# Altium schematic sheet Main.SchDoc
size A3; SheetNumber: 1; SheetTotal: 4
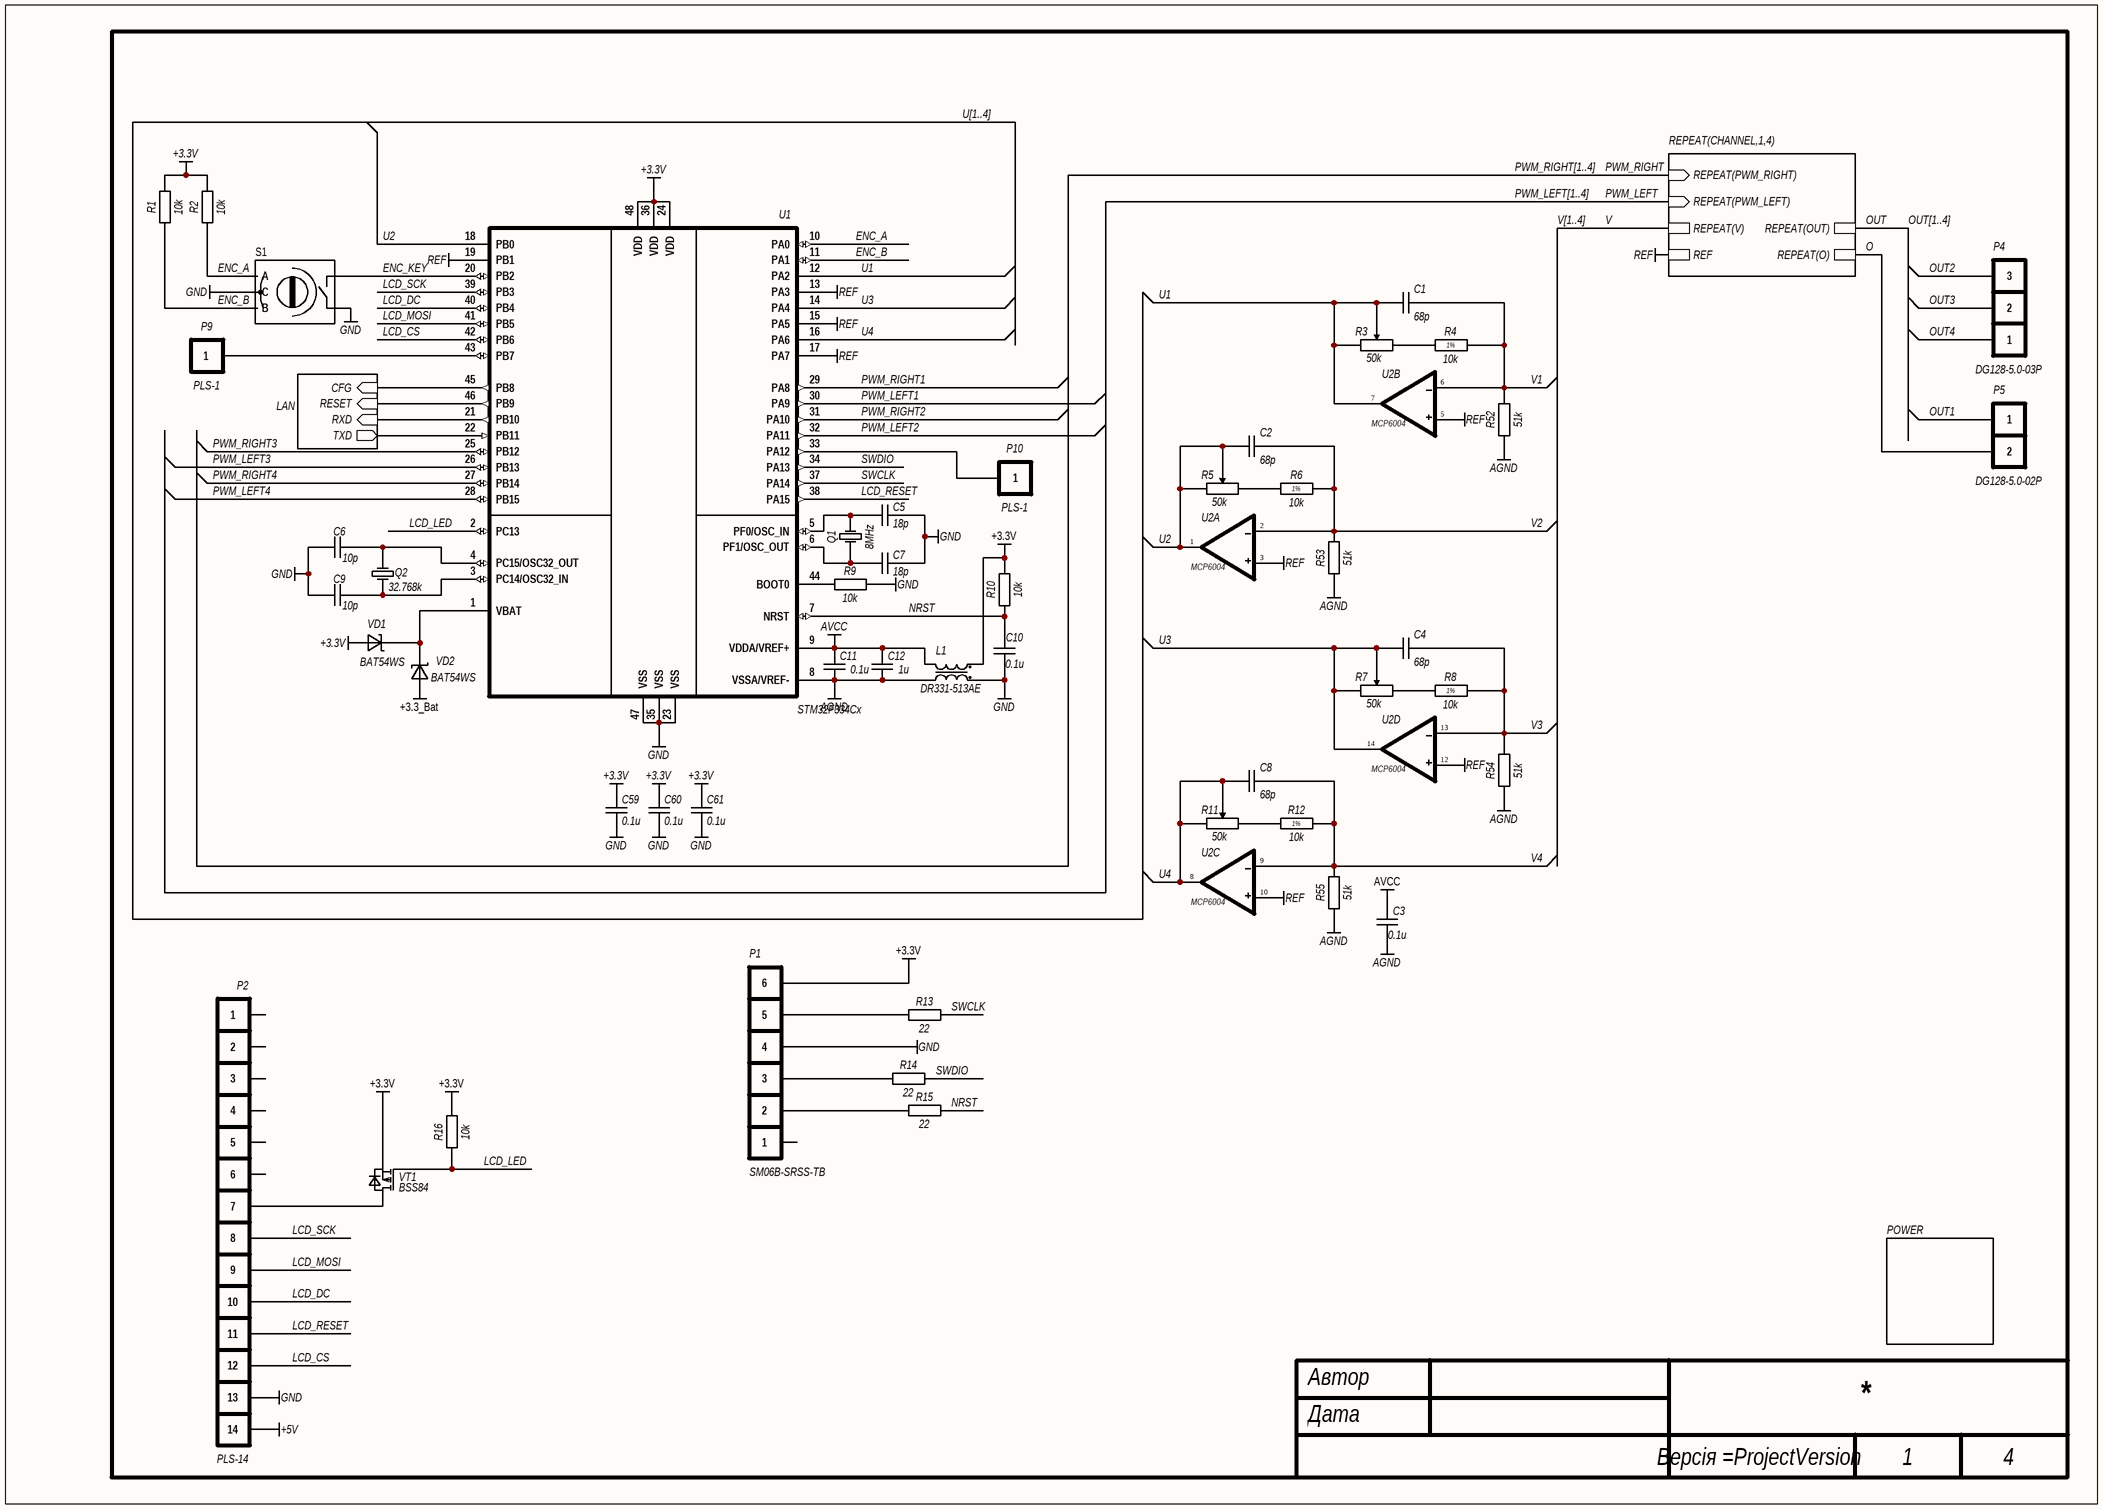
[diagram p0: Main.SchDoc]

## Parts
C1  68p  [C0603(1608)]
C2  68p  [C0603(1608)]
C3  0.1u  [C0603(1608)]
C4  68p  [C0603(1608)]
C5  18p  [C0603(1608)]
C6  10p  [C0603(1608)]
C7  18p  [C0603(1608)]
C8  68p  [C0603(1608)]
C9  10p  [C0603(1608)]
C10  0.1u  [C0603(1608)]
C11  0.1u  [C0603(1608)]
C12  1u  [C0603(1608)]
C59  0.1u  [C0603(1608)]
C60  0.1u  [C0603(1608)]
C61  0.1u  [C0603(1608)]
L1  DR331-513AE  [DR331]
P1  SM06B-SRSS-TB  [SM06B-SRSS-TB]
P2  PLS-14  [PLS-14]
P4  DG128-5.0-03P  [DG128-5.0-03P]
P5  DG128-5.0-02P  [DG128-5.0-02P]
P9  PLS-1  [PLS-1]
P10  PLS-1  [PLS-1]
Q1  8MHz  [KX-7T]
Q2  32.768k  [KX-327S]
R1  10k  [R0603]
R2  10k  [R0603]
R3  50k  [T910W (3296W)]
R4  10k  Accuracy: 1%  [R0603]
R5  50k  [T910W (3296W)]
R6  10k  Accuracy: 1%  [R0603]
R7  50k  [T910W (3296W)]
R8  10k  Accuracy: 1%  [R0603]
R9  10k  [R0603]
R10  10k  [R0603]
R11  50k  [T910W (3296W)]
R12  10k  Accuracy: 1%  [R0603]
R13  22  [R0603]
R14  22  [R0603]
R15  22  [R0603]
R16  10k  [R0603]
R52  51k  [R0603]
R53  51k  [R0603]
R54  51k  [R0603]
R55  51k  [R0603]
S1  EC12D  [EC12D]  (value not drawn)
U1  STM32F334Сx  [LQFP48]  (value not drawn)
U2  MCP6004  [TSSOP-14]  (parts A,B,C,D of 4)
VD1  BAT54WS  [SOD323]
VD2  BAT54WS  [SOD323]
VT1  BSS84  [SOT23]

## Sub-sheets
LAN = LAN.SchDoc: CFG (in), RESET (in), TXD (out), RXD (in)
POWER = Power.SchDoc: no entries
REPEAT(CHANNEL,1,4) = Channel.SchDoc: REF, REPEAT(V), REPEAT(PWM_LEFT) (in), REPEAT(PWM_RIGHT) (in), REPEAT(OUT), REPEAT(O)

## Nets
+3.3_Bat: VD2.1(A)
+3.3V: C59.2 C60.2 C61.2 L1.2 P1.6 R1.2 R2.2 R10.2 R16.2 U1.24(VDD) U1.36(VDD) U1.48(VDD) VD1.1(A) VT1.2(S)
+5V: P2.14
AGND: C3.1 C11.1 C12.1 L1.4 R52.1 R53.1 R54.1 R55.1 U1.8(VSSA/VREF-) U2.11(V-)
AVCC: C3.2 C11.2 C12.2 L1.3 U1.9(VDDA/VREF+) U2.4(V+)
GND: C5.2 C6.2 C7.2 C9.2 C10.1 C59.1 C60.1 C61.1 L1.1 P1.4 P2.13 R9.2 S1.C S1.E U1.23(VSS) U1.35(VSS) U1.47(VSS)
REF: U1.13(PA3) U1.15(PA5) U1.17(PA7) U1.19(PB1) U2.3(+IN) U2.5(+IN) U2.10(+IN) U2.12(+IN) ; sheet REPEAT(CHANNEL,1,4)/REF
ENC_A: R2.1 S1.A U1.10(PA0)
ENC_B: R1.1 S1.B U1.11(PA1)
ENC_KEY: S1.D U1.20(PB2)
LCD_CS: P2.12 U1.42(PB6)
LCD_DC: P2.10 U1.40(PB4)
LCD_LED: R16.1 U1.2(PC13) VT1.1(G)
LCD_MOSI: P2.9 U1.41(PB5)
LCD_RESET: P2.11 U1.38(PA15)
LCD_SCK: P2.8 U1.39(PB3)
NRST: C10.2 R10.1 R15.2 U1.7(NRST)
O: P5.2 ; sheet REPEAT(CHANNEL,1,4)/REPEAT(O)
OUT: sheet REPEAT(CHANNEL,1,4)/REPEAT(OUT)
OUT1: P5.1
OUT2: P4.3
OUT3: P4.2
OUT4: P4.1
PWM_LEFT: sheet REPEAT(CHANNEL,1,4)/REPEAT(PWM_LEFT)
PWM_LEFT1: U1.30(PA9)
PWM_LEFT2: U1.32(PA11)
PWM_LEFT3: U1.26(PB13)
PWM_LEFT4: U1.28(PB15)
PWM_RIGHT: sheet REPEAT(CHANNEL,1,4)/REPEAT(PWM_RIGHT)
PWM_RIGHT1: U1.29(PA8)
PWM_RIGHT2: U1.31(PA10)
PWM_RIGHT3: U1.25(PB12)
PWM_RIGHT4: U1.27(PB14)
SWCLK: R13.2 U1.37(PA14)
SWDIO: R14.2 U1.34(PA13)
U1: C1.2 R3.2 R3.3 U1.12(PA2) U2.7(OUT)
U2: C2.2 R5.2 R5.3 U1.18(PB0) U2.1(OUT)
U3: C4.2 R7.2 R7.3 U1.14(PA4) U2.14(OUT)
U4: C8.2 R11.2 R11.3 U1.16(PA6) U2.8(OUT)
V: sheet REPEAT(CHANNEL,1,4)/REPEAT(V)
V1: C1.1 R4.1 R52.2 U2.6(-IN)
V2: C2.1 R6.1 R53.2 U2.2(-IN)
V3: C4.1 R8.1 R54.2 U2.13(-IN)
V4: C8.1 R12.1 R55.2 U2.9(-IN)
NetC5_1: C5.1 Q1.1 U1.5(PF0/OSC_IN)
NetC6_1: C6.1 Q2.2 U1.4(PC15/OSC32_OUT)
NetC7_1: C7.1 Q1.2 U1.6(PF1/OSC_OUT)
NetC9_1: C9.1 Q2.1 U1.3(PC14/OSC32_IN)
NetP1_2: P1.2 R15.1
NetP1_3: P1.3 R14.1
NetP1_5: P1.5 R13.1
NetP2_7: P2.7 VT1.3(D)
NetP9_1: P9.1 U1.43(PB7)
NetP10_1: P10.1 U1.33(PA12)
NetR3_1: R3.1 R4.2
NetR5_1: R5.1 R6.2
NetR7_1: R7.1 R8.2
NetR9_1: R9.1 U1.44(BOOT0)
NetR11_1: R11.1 R12.2
NetU1_1: U1.1(VBAT) VD1.2(K) VD2.2(K)
NetU1_21: U1.21(PB10) ; sheet LAN/RXD
NetU1_22: U1.22(PB11) ; sheet LAN/TXD
NetU1_45: U1.45(PB8) ; sheet LAN/CFG
NetU1_46: U1.46(PB9) ; sheet LAN/RESET

Not connected (* = marked no-connect by the designer): P1 1; P2 1 2 3 4 5 6

## Buses and harness runs
bus OUT[1..4]
bus PWM_LEFT[1..4]
bus PWM_RIGHT[1..4]
bus U[1..4]
bus V[1..4]

## Notes on the sheet
- Автор
- Дата

## Library data of the parts
C1-C12 C59-C61 = Capasitor SMD: Model: *
  C1 C2 C4 C8: Value: 68p
  C3 C10 C11 C59-C61: Value: 0.1u
  C5 C7: Value: 18p
  C6 C9: Value: 10p
  C12: Value: 1u
L1 = Chocke Inductor: Model: DR331-513AE
P4 = DG128-5.0-03P: 20A/300V AC 5mm
P5 = DG128-5.0-02P: 20A/300V AC 5mm
Q1 = XTAL: pin to pad: 2>3; Value: 8MHz
Q2 = XTAL: pin to pad: 2>4; Value: 32.768k
R1 R2 R4 R6 R8-R10 R12-R16 R52-R55 = Resistor SMD: Model: *
  R1 R2 R4 R6 R8-R10 R12 R16: Value: 10k
  R13-R15: Value: 22
  R52-R55: Value: 51k
R3 R5 R7 R11 = Trimming Resistor: Set Position: 0.5; Value: 50k
S1 = Encoder with switch
U1 = STM32F334Cx: ARM Cortex-M4 series Microcontroller IC 32-Bit 72MHz 16KB (16K x 8) FLASH 48-LQFP (7x7)
U2 = MCP6004: Low cost, low power, input/output rail-to-rail operational amplifiers. 1.8 - 6V, 1MHz, 100uA
VD1 VD2 = BAT54WS: SOD323 Schottky 30V 230mA
VT1 = BSS84: P-MOS -50V 1.2(10.0)Ω -130(520)mA